# Altium schematic sheet Control_Unit.SchDoc
size A2
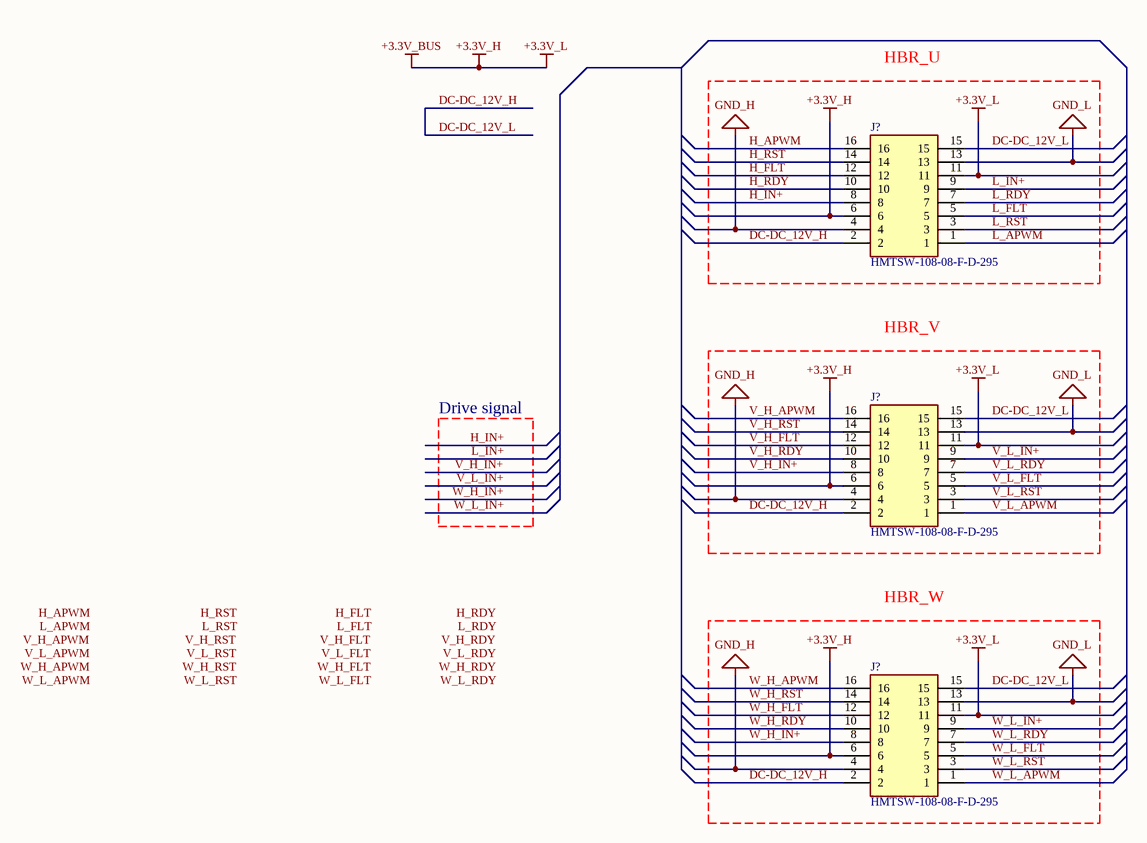
[diagram p0: Control_Unit.SchDoc]

## Parts
(Parts that share a designator on the sheet are numbered #1, #2 ... from top to bottom, then left to right.)
J?#1  HMTSW-108-08-F-D-295  [HDRV16W64P254_2X8_2032X502X1117P]
J?#2  HMTSW-108-08-F-D-295  [HDRV16W64P254_2X8_2032X502X1117P]
J?#3  HMTSW-108-08-F-D-295  [HDRV16W64P254_2X8_2032X502X1117P]

## Blocks framed on the sheet
HBR_U: J?#1
HBR_V: J?#2
HBR_W: J?#3

## Nets
+3.3V_BUS: J?#1.6 J?#1.11 J?#2.6 J?#2.11 J?#3.6 J?#3.11  [also labelled +3.3V_H, +3.3V_L]
GND_H: J?#1.4 J?#2.4 J?#3.4
GND_L: J?#1.13 J?#2.13 J?#3.13
DC-DC_12V_H: J?#1.2 J?#1.15 J?#2.2 J?#2.15 J?#3.2 J?#3.15  [also labelled DC-DC_12V_L]
H_APWM: J?#1.16
H_FLT: J?#1.12
H_IN+: J?#1.8
H_RDY: J?#1.10
H_RST: J?#1.14
L_APWM: J?#1.1
L_FLT: J?#1.5
L_IN+: J?#1.9
L_RDY: J?#1.7
L_RST: J?#1.3
V_H_APWM: J?#2.16
V_H_FLT: J?#2.12
V_H_IN+: J?#2.8
V_H_RDY: J?#2.10
V_H_RST: J?#2.14
V_L_APWM: J?#2.1
V_L_FLT: J?#2.5
V_L_IN+: J?#2.9
V_L_RDY: J?#2.7
V_L_RST: J?#2.3
W_H_APWM: J?#3.16
W_H_FLT: J?#3.12
W_H_IN+: J?#3.8
W_H_RDY: J?#3.10
W_H_RST: J?#3.14
W_L_APWM: J?#3.1
W_L_FLT: J?#3.5
W_L_IN+: J?#3.9
W_L_RDY: J?#3.7
W_L_RST: J?#3.3

## Notes on the sheet
- Drive signal
- Labels drawn without touching a wire or pin: H_APWM, H_FLT, H_RDY, H_RST, L_APWM, L_FLT, L_RDY, L_RST, V_H_APWM, V_H_FLT, V_H_RDY, V_H_RST, V_L_APWM, V_L_FLT, V_L_RDY, V_L_RST, W_H_APWM, W_H_FLT, W_H_RDY, W_H_RST, W_L_APWM, W_L_FLT, W_L_RDY, W_L_RST

## Library data of the parts
J?#1-J?#3 = HMTSW-108-08-F-D-295: Connector; Manufacturer_Name: SAMTEC; Datasheet Link: https://ru.mouser.com/datasheet/2/527/hmtsw-1370239.pdf; Height: 11.17mm; Manufacturer_Part_Number: HMTSW-108-08-F-D-295